# EAGLE design light_module (EAGLE 9.3.0)
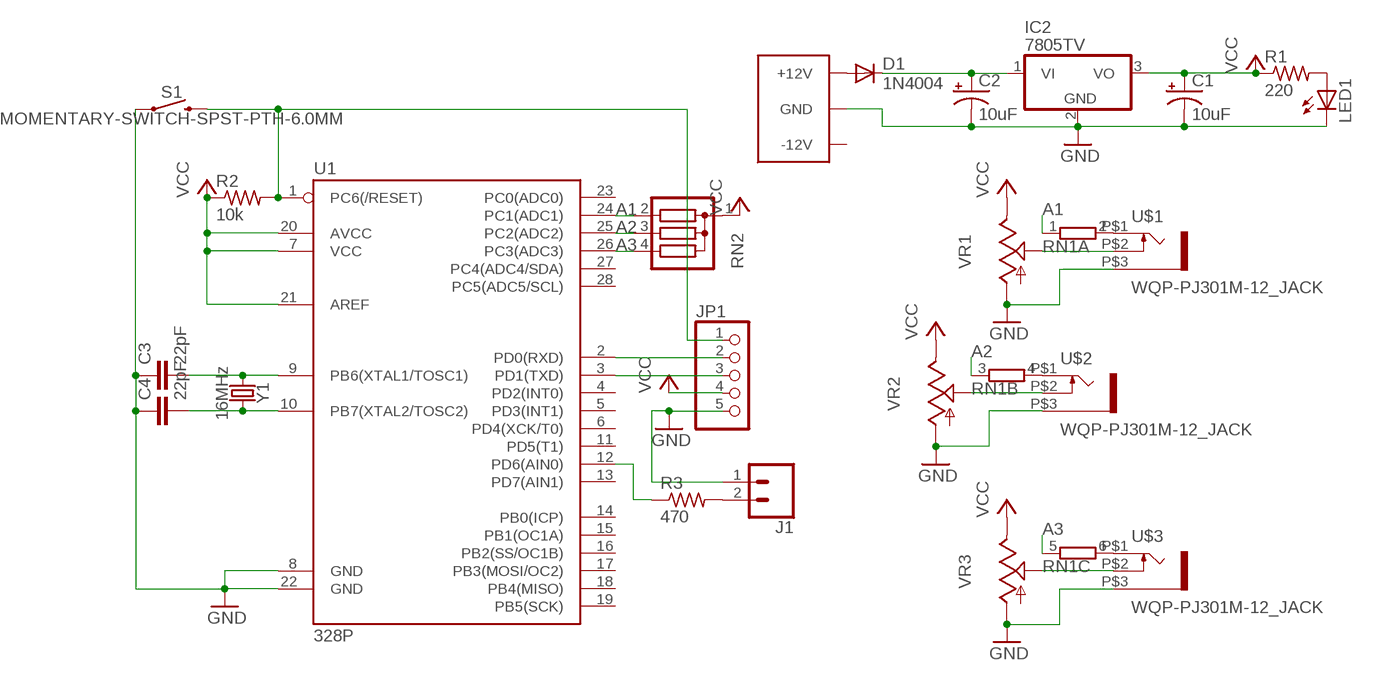
[diagram p0: schematic, sheet 1]

## Parts
C1  10uF  10UF-POLAR-RADIAL-2.5MM-25V-20%  [CPOL-RADIAL-2.5MM-5MM]
C2  10uF  10UF-POLAR-RADIAL-2.5MM-25V-20%  [CPOL-RADIAL-2.5MM-5MM]
C3  22pF  22PF-PTH-2.54MM-200V-5%  [CAP-PTH-2.54]
C4  22pF  22PF-PTH-2.54MM-200V-5%  [CAP-PTH-2.54]
C5  EURO_POWER_LOCKSKINNY  [EURO_POWER_HEADER]
D1  1N4004  [DO41-10]
IC2  7805TV  [TO220V]
J1  CONN_02SPRING-2.54-RA  [SPRINGTERMINAL-2.54MM-2]
JP1  PINHD-1X5  [1X05]
LED1  LED5MM  [LED5MM]
R1  220  R-US_0207/2V  [0207/2V]
R2  10k  R-US_0207/2V  [0207/2V]
R3  470  R-US_0207/2V  [0207/2V]
RN1  E3R  [SIL6]
RN2  G03R  [SIL4]
S1  MOMENTARY-SWITCH-SPST-PTH-6.0MM  [TACTILE_SWITCH_PTH_6.0MM]
U1  328P  ATMEGA328P_PDIP  [DIP28]
U$1  WQP-PJ301M-12_JACK  [WQP-PJ301M-12_JACK]
U$2  WQP-PJ301M-12_JACK  [WQP-PJ301M-12_JACK]
U$3  WQP-PJ301M-12_JACK  [WQP-PJ301M-12_JACK]
VR1  9MM_SNAP-IN_POT_  [9MM_SNAP-IN_POT]
VR2  9MM_SNAP-IN_POT_  [9MM_SNAP-IN_POT]
VR3  9MM_SNAP-IN_POT_  [9MM_SNAP-IN_POT]
Y1  16MHz  CRYSTAL-16MHZPTH-HC49US  [HC49US]

## Nets
A1: RN1.1 RN2.2 U1.24(PC1(ADC1))
A2: RN1.3 RN2.3 U1.25(PC2(ADC2))
A3: RN1.5 RN2.4 U1.26(PC3(ADC3))
GND: C1.2(-) C2.2(-) C3.1 C4.1 C5.3(GND) C5.4(GND) C5.5(GND) C5.6(GND) C5.7(GND) C5.8(GND) IC2.2(GND) J1.1 JP1.5 LED1.K(C) S1.1 U1.8(GND) U1.22(GND) U$1.P$3 U$2.P$3 U$3.P$3 VR1.1(A) VR2.1(A) VR3.1(A)
N$1: C5.9(+12V) C5.10(+12V) D1.A
N$2: C2.1(+) D1.C IC2.1(VI)
N$3: LED1.A R1.2
N$4: JP1.1 R2.2 S1.3 U1.1(PC6(/RESET))
N$5: C3.2 U1.9(PB6(XTAL1/TOSC1)) Y1.1
N$6: C4.2 U1.10(PB7(XTAL2/TOSC2)) Y1.2
N$7: JP1.2 U1.2(PD0(RXD))
N$8: JP1.3 U1.3(PD1(TXD))
N$9: U$1.P$2 VR1.2(S)
N$10: U$2.P$2 VR2.2(S)
N$11: U$3.P$2 VR3.2(S)
N$12: J1.2 R3.2
N$13: R3.1 U1.12(PD6(AIN0))
N$14: RN1.2 U$1.P$1
N$15: RN1.4 U$2.P$1
N$16: RN1.6 U$3.P$1
VCC: C1.1(+) IC2.3(VO) JP1.4 R1.1 R2.1 RN2.1 U1.7(VCC) U1.20(AVCC) U1.21(AREF) VR1.3(E) VR2.3(E) VR3.3(E)
Unconnected: C5.1(-12V) C5.2(-12V) U1.4(PD2(INT0)) U1.5(PD3(INT1)) U1.6(PD4(XCK/T0)) U1.11(PD5(T1)) U1.13(PD7(AIN1)) U1.14(PB0(ICP)) U1.15(PB1(OC1A)) U1.16(PB2(SS/OC1B)) U1.17(PB3(MOSI/OC2)) U1.18(PB4(MISO)) U1.19(PB5(SCK)) U1.23(PC0(ADC0)) U1.27(PC4(ADC4/SDA)) U1.28(PC5(ADC5/SCL))

## Library data of the parts
C1 C2 = SparkFun-Capacitors:10UF-POLAR: 10.0µF polarized capacitors A capacitor is a passive two-terminal electrical component used to store electrical energy temporarily in an electric field.; PROD_ID: CAP-08440
C3 C4 = SparkFun-Capacitors:22PF: 22pF ceramic capacitors A capacitor is a passive two-terminal electrical component used to store electrical energy temporarily in an electric field.; PROD_ID: CAP-09128
C5 = MusicThingModular:EURO_POWER_LOCK
D1 = adafruit:1N4004: DIODE General purpose 1N400x type rectifier (With bigger pads) http://www.ladyada.net/library/pcb/eaglelibrary.html
IC2 = linear:78*: Positive VOLTAGE REGULATOR Source: http://cache.national.com/ds/LM/LM78L05.pdf http://www.fairchildsemi.com/ds/LM/LM7805.pdf
J1 = SparkFun-Connectors:CONN_02: Multi connection point. Often used as Generic Header-pin footprint for 0.1 inch spaced/style header connections On any of the 0.1 inch spaced packages, you can populate with these: Break Away Headers - Straight <https://www.sparkfun.com/products/116> (PRT-00116) Break Away Male Headers - Right Angle <https://www.sparkfun.com/products/553> (PRT-00553) Female Headers <https://www.sparkfun.com/products/115> (PRT-00115) Break Away Headers - Machine Pin <https://www.sparkfun.com/products/117> (PRT-00117) Break Away Female Headers - Swiss Machine Pin <https://www.sparkfun.com/products/743> (PRT-00743) For SCREWTERMINALS and SPRING TERMINALS visit here: Screw Terimnals on SparkFun.com <https://www.sparkfun.com/search/results?term=Screw+Terminals> (5mm/3.5mm/2.54mm spacing) This device is also useful as a general connection point to wire up your design to another part of your project. Our various solder wires solder well into these plated through hole pads. Hook-Up Wire - Assortment (Stranded, 22 AWG) <https://www.sparkfun.com/products/11375> (PRT-11375) Hook-Up Wire - Assortment (Solid Core, 22 AWG) <https://www.sparkfun.com/products/11367> (PRT-11367) View the entire wire category on our website here <https://www.sparkfun.com/categories/141> Special notes: Molex polarized connector foot print use with: PRT-08233 with associated crimp pins and housings. 2.54_SCREWTERM for use with PRT-10571. 3.5mm Screw Terminal footprints for PRT-08084 5mm Screw Terminal footprints for use with PRT-08432
JP1 = pinhead:PINHD-1X5: PIN HEADER
LED1 = adafruit:LED: LED OSRAM: - CHIPLED LG R971, LG N971, LY N971, LG Q971, LY Q971, LO R971, LY R971 LH N974, LH R974 LS Q976, LO Q976, LY Q976 LO Q996 - Hyper CHIPLED LW Q18S LB Q993, LB Q99A, LB R99A - SideLED LS A670, LO A670, LY A670, LG A670, LP A670 LB A673, LV A673, LT A673, LW A673 LH A674 LY A675 LS A676, LA A676, LO A676, LY A676, LW A676 LS A679, LY A679, LG A679 - Hyper Micro SIDELED® LS Y876, LA Y876, LO Y876, LY Y876 LT Y87S - SmartLED LW L88C, LW L88S LB L89C, LB L89S, LG L890 LS L89K, LO L89K, LY L89K LS L896, LA L896, LO L896, LY L896 - TOPLED LS T670, LO T670, LY T670, LG T670, LP T670 LSG T670, LSP T670, LSY T670, LOP T670, LYG T670 LG T671, LOG T671, LSG T671 LB T673, LV T673, LT T673, LW T673 LH T674 LS T676, LA T676, LO T676, LY T676, LB T676, LH T676, LSB T676, LW T676 LB T67C, LV T67C, LT T67C, LS T67K, LO T67K, LY T67K, LW E67C LS E67B, LA E67B, LO E67B, LY E67B, LB E67C, LV E67C, LT E67C LW T67C LS T679, LY T679, LG T679 LS T770, LO T770, LY T770, LG T770, LP T770 LB T773, LV T773, LT T773, LW T773 LH T774 LS E675, LA E675, LY E675, LS T675 LS T776, LA T776, LO T776, LY T776, LB T776 LHGB T686 LT T68C, LB T68C - Hyper Mini TOPLED® LB M676 - Mini TOPLED Santana® LG M470 LS M47K, LO M47K, LY M47K Source: http://www.osram.convergy.de/
R1-R3 = resistor:R-US_: RESISTOR, American symbol
RN1 = resistor-sil:E3R: SIL RESISTOR; OC_FARNELL: unknown; OC_NEWARK: unknown
RN2 = resistor-sil:G03R: SIL RESISTOR; OC_FARNELL: unknown; OC_NEWARK: unknown
S1 = SparkFun-Switches:MOMENTARY-SWITCH-SPST: Momentary Switch (Pushbutton) - SPST Normally-open (NO) SPST momentary switches (buttons, pushbuttons). Variants PTH-12MM - 12mm square, through-hole Momentary Pushbutton Switch - 12mm Square <https://www.sparkfun.com/products/9190> (COM-09190) PTH-6.0MM, PTH-6.0MM-KIT - 6.0mm square, through-hole Mini Pushbutton Switch <https://www.sparkfun.com/products/97> (COM-00097) KIT package intended for soldering kit's - only one side of pads' copper is exposed. PTH-RIGHT-ANGLE-KIT - Right-angle, through-hole Right Angle Tactile Button <https://www.sparkfun.com/products/10791> - Used on SparkFun BigTime Watch Kit <https://www.sparkfun.com/products/11734> SMD-12MM - 12mm square, surface-mount Tactile Button - SMD (12mm) <https://www.sparkfun.com/products/12993> (COM-12993) Used on SparkFun PicoBoard <https://www.sparkfun.com/products/11888> SMD-4.5MM - 4.5mm Square Trackball Switch Used on SparkFun Blackberry Trackballer Breakout <https://www.sparkfun.com/products/13169> SMD-4.6MMX2.8MM - 4.60mm x 2.80mm, surface mount Used on SparkFun SAMD21 Mini Breakout <https://www.sparkfun.com/products/13664> SMD-5.2MM, SMD-5.2-REDUNDANT - 5.2mm square, surface-mount Mini Pushbutton Switch - SMD <https://www.sparkfun.com/products/8720> (COM-08720) Used on Arduino Pro Mini <https://www.sparkfun.com/products/11114> REDUNDANT package connects both switch circuits together SMD-6.0X3.5MM - 6.0 x 3.5mm, surface mount Momentary Reset Switch SMD <https://www.sparkfun.com/products/8229> (COM-08229) SMD-6.2MM-TALL - 6.2mm square, surface mount Tactile Button - SMD (6mm) <https://www.sparkfun.com/products/12992> Used on SparkFun Digital Sandbox <https://www.sparkfun.com/products/12651> SMD-RIGHT-ANGLE - Right-angle, surface mount Used on SparkFun Block for Intel® Edison - Arduino <https://www.sparkfun.com/products/13036>; PROD_ID: SWCH-08441; SF_SKU: COM-00097
U1 = SparkFun-IC-Microcontroller:ATMEGA328P_PDIP: Atmel 328P Through hole ATMEGA328P uC used in the Arduino 32kb flash, 1k EEPROM, 2k SRAM Datasheet <http://www.sparkfun.com/datasheets/Components/SMD/ATMega328.pdf> SparkFun Products Storefront component: AVR 28 Pin 20MHz 32K 6A/D - ATMega328P <https://www.sparkfun.com/products/9061> (COM-09061) SparkFun Simon Says - Through-Hole Soldering Kit <https://www.sparkfun.com/products/10547> (KIT-10547) SparkFun Learn to Solder - Simon Says <https://www.sparkfun.com/products/13708> (KIT-13708) SparkFun BigTime Watch Kit <https://www.sparkfun.com/products/11734> (KIT-11734) SparkFun ClockIt <https://www.sparkfun.com/products/10930> (KIT-10930) SparkFun Serial Enabled LCD Kit <https://www.sparkfun.com/products/10097> (LCD-10097) SparkFun Simon Tilts - Through Hole Soldering Kit <https://www.sparkfun.com/products/12634> (KIT-12634) SparkFun Frequency Counter Kit <https://www.sparkfun.com/products/10140> (KIT-10140) FabFM Radio Kit <https://www.sparkfun.com/products/11043> (KIT-11043) SparkFun Binary Blaster Kit <https://www.sparkfun.com/products/12037> (KIT-12037) SparkFun Metro-Gnome <https://www.sparkfun.com/products/9236> (KIT-09236) ATmega328 with Arduino Optiboot (Uno) <https://www.sparkfun.com/products/10524> (DEV-10524); PROD_ID: IC-09136
U$1-U$3 = thonkiconn:WQP-PJ301M-12_JACK
VR1-VR3 = MusicThingModular:9MM_SNAP-IN_POT: 9mm vertical snap-in pot, Alpha / Panasonic style
Y1 = SparkFun-Clocks:CRYSTAL-16MHZ: 16MHz Crystal Digikey Example <http://www.digikey.com/product-search/en?keywords=535-9122-1-ND> Frequency: 16MHz Frequency Stability: ±50ppm Frequency Tolerance: ±20ppm Load Capacitance: 18pF SparkFun Products: Pro Micro -5V/16MHz <https://www.sparkfun.com/products/12640> SparkFun Serial Enabled LCD Kit <https://www.sparkfun.com/products/10097>; PROD_ID: XTAL-08181; SF_ID: COM-00536

## Board
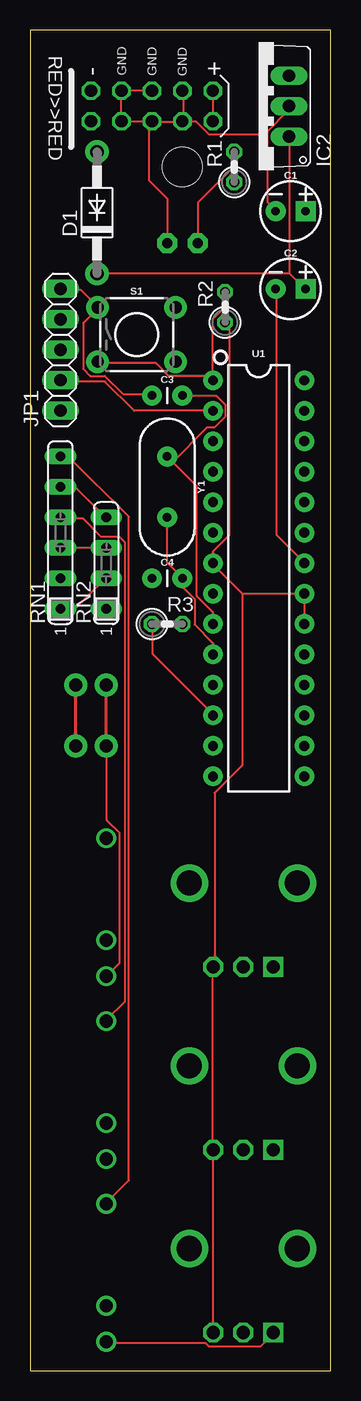
[diagram p1: board, top side]
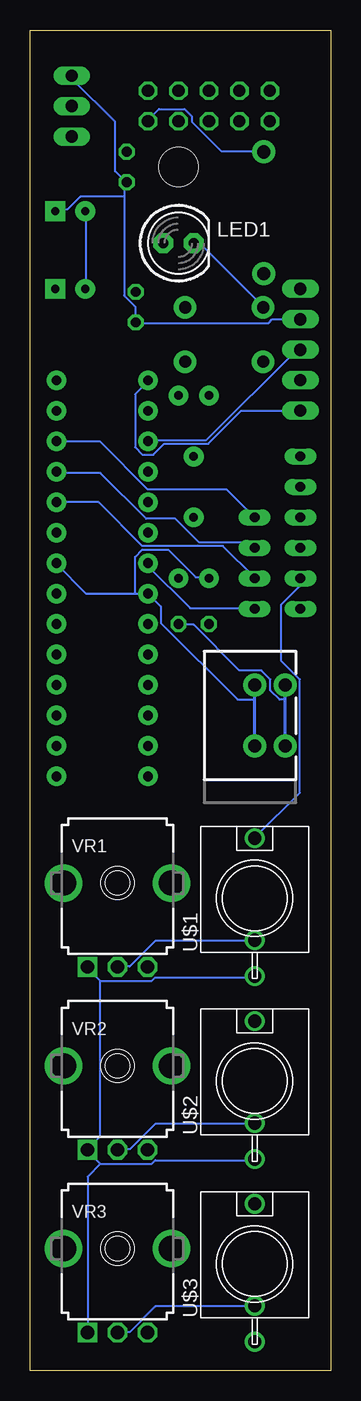
[diagram p2: board, bottom side, seen from below]

Size 25.07 x 111.75 mm. Coordinates in mm from the lower left corner, seen from the top.
Outline: 0,0 25.07,0 25.07,111.75 0,111.75 0,0
Copper layers (1*16): Top 0.035mm / dielectric 1.5mm / Bottom 0.035mm
Design rules "default": minimum track width 6mil, minimum drill 0.35mm, track to track 6mil, track to pad 6mil, pad to pad 6mil, via to via 6mil, smd to smd 6mil, copper to edge 40mil, drill to drill 6mil, minimum pad ring 10mil, minimum via ring 8mil, stop-mask expansion 4mil, vias tented up to drill 0mil, thermal gap 10mil
Holes 3.3 mm at 12.7,100.33

### Footprints (pad centres in the part's own frame; a part is rotated, then mirrored left to right if it is on the bottom)
CPOL-RADIAL-2.5MM-5MM = drill 0.7 pad 1.651 square: 1 1.25,0 | drill 0.7 pad 1.651: 2 -1.25,0
CAP-PTH-2.54 = drill 0.7 pad 1.651: 1 -1.27,0; 2 1.27,0
EURO_POWER_HEADER = drill 1.016 octagon: 1 -5.08,-1.27; 2 -5.08,1.27; 3 -2.54,-1.27; 4 -2.54,1.27; 5 0,-1.27; 6 0,1.27; 7 2.54,-1.27; 8 2.54,1.27; 9 5.08,-1.27; 10 5.08,1.27
DO41-10 = drill 1.118 pad 1.93: A 5.08,0; C -5.08,0
TO220V = drill 1.016 long: 1 -2.54,-2.54; 2 0,-2.54; 3 2.54,-2.54
SPRINGTERMINAL-2.54MM-2 = drill 1.1 pad 1.9: 1 0,0; 2 2.54,0; P$2 0,5.08; P$3 2.54,5.08
1X05 = drill 1.016 long: 1 -5.08,0; 2 -2.54,0; 3 0,0; 4 2.54,0; 5 5.08,0
LED5MM = drill 0.813 pad 1.676 octagon: A -1.27,0; K 1.27,0
0207/2V = drill 0.813 octagon: 1 -1.27,0; 2 1.27,0
SIL6 = drill 0.813 long: 1 -6.35,0; 2 -3.81,0; 3 -1.27,0; 4 1.27,0; 5 3.81,0; 6 6.35,0
SIL4 = drill 0.813 long: 1 -3.81,0; 2 -1.27,0; 3 1.27,0; 4 3.81,0
TACTILE_SWITCH_PTH_6.0MM = drill 1.016 pad 1.88: 1 -3.251,2.261; 2 3.251,2.261; 3 -3.251,-2.261; 4 3.251,-2.261
DIP28 = drill 0.813 pad 1.626: 1 -16.51,-3.81; 2 -13.97,-3.81; 3 -11.43,-3.81; 4 -8.89,-3.81; 5 -6.35,-3.81; 6 -3.81,-3.81; 7 -1.27,-3.81; 8 1.27,-3.81; 9 3.81,-3.81; 10 6.35,-3.81; 11 8.89,-3.81; 12 11.43,-3.81; 13 13.97,-3.81; 14 16.51,-3.81; 15 16.51,3.81; 16 13.97,3.81; 17 11.43,3.81; 18 8.89,3.81; 19 6.35,3.81; 20 3.81,3.81; 21 1.27,3.81; 22 -1.27,3.81; 23 -3.81,3.81; 24 -6.35,3.81; 25 -8.89,3.81; 26 -11.43,3.81; 27 -13.97,3.81; 28 -16.51,3.81
WQP-PJ301M-12_JACK = drill 1.1: P$1 0,5; P$2 0,-3.5; P$3 0,-6.5
9MM_SNAP-IN_POT = drill 1.1 square: 1 -2.5,-7 | drill 1.1 octagon: 2 0,-7; 3 2.5,-7 | drill 2.1 pad 2.794: CHASSIS1 -4.5,0; CHASSIS2 4.5,0
HC49US = drill 0.7 pad 1.651: 1 -2.54,0; 2 2.54,0

### Placement (x,y rotation side)
C1  21.72,96.65 0 top
C2  21.72,90.17 0 top
C3  11.43,81.28 0 top
C4  11.43,66.04 0 top
C5  10.16,105.41 0 top
D1  5.59,96.52 90 top
IC2  19.05,105.41 90 top
J1  6.35,52.07 0 bottom
JP1  2.54,85.09 90 top
LED1  12.7,93.98 0 bottom
R1  17.02,100.33 90 top
R2  16.26,88.65 90 top
R3  11.43,62.23 0 top
RN1  2.54,69.85 90 top
RN2  6.35,67.31 90 top
S1  8.89,86.36 0 top
U1  19.05,66.04 270 top
U$1  6.35,39.37 0 bottom
U$2  6.35,24.13 0 bottom
U$3  6.35,8.89 0 bottom
VR1  17.78,40.64 0 bottom
VR2  17.78,25.4 0 bottom
VR3  17.78,10.16 0 bottom
Y1  11.43,73.66 270 top

### Tracks (layer width: path | path; a pad name or v marks a point on that pad's centre or on a via)
A1
  Top 0.152: RN1.1 2.59,63.55 3.81,63.55 6.25,65.99 RN2.2
  Bottom 0.152: U1.24 19.36,72.39 15.7,68.73 8.99,68.73 6.4,66.14 RN2.2
A2
  Top 0.152: RN2.3 RN1.3
  Bottom 0.152: U1.25 22.86,74.83 19.2,74.83 15.39,71.02 12.95,71.02 10.97,69.04 6.86,69.04 6.4,68.58 RN2.3
A3
  Top 0.152: RN1.5 2.59,73.61 3.81,73.61 6.25,71.17 RN2.4
  Bottom 0.152: RN2.4 8.69,73.46 15.24,73.46 19.2,77.42 22.86,77.42 U1.26
GND
  Top 0.152: JP1.5 2.59,90.07 4.27,90.07 5.64,88.7 S1.1 5.64,88.54 4.42,87.33 4.42,83.52 5.03,82.91 6.25,82.91 7.77,81.38 10.06,81.38 C3.1 | C5.6 C5.4 C5.3 7.62,104.09 9.91,104.09 | 9.91,104.09 10.06,104.09 C5.5 | C5.7 12.65,104.09 10.21,104.09 C5.5 | C5.8 12.8,106.68 12.8,104.24 C5.7 | 19.81,103.02 19.81,97.38 20.42,96.77 C1.2 | 19.81,103.02 19.81,103.33 21.49,105 21.49,105.31 IC2.2 | 19.81,103.02 14.94,103.02 13.87,104.09 12.8,104.09 C5.7 | LED1.K 11.43,97.69 9.91,99.21 9.91,104.09 | 9.91,104.09 C5.5 | U$3.P$3 6.4,2.29 14.63,2.29 14.94,1.98 19.2,1.98 20.27,3.05 VR3.1 | J1.1 6.4,51.97 6.4,45.87 7.47,44.81 7.47,33.98 6.4,32.92 U$1.P$3 | C2.2 20.57,90.07 20.57,69.65 22.86,67.36 U1.22
  Bottom 0.152: LED1.K 11.43,93.88 10.82,93.88 5.64,88.7 S1.1 | C2.2 20.42,90.22 20.42,96.62 C1.2 | 16.31,64.77 20.42,64.77 22.86,67.21 U1.22 | 16.31,64.77 U1.8 14.17,63.7 14.17,62.33 7.77,55.93 6.4,55.93 J1.1 | 16.31,64.77 16.31,67.82 15.7,68.43 13.56,68.43 11.28,66.14 10.21,66.14 C4.1 | 19.2,32.46 14.94,32.46 14.63,32.77 6.4,32.77 U$1.P$3 | 19.2,32.46 20.27,33.53 VR1.1 | 19.2,17.22 14.94,17.22 14.63,17.53 6.4,17.53 U$2.P$3 | 19.2,17.22 20.27,18.29 VR2.1 20.27,18.44 19.2,19.51 19.2,32.46 | 19.2,17.22 20.27,16.15 20.27,3.2 VR3.1
N$1
  Top 0.152: C5.10 C5.9
  Bottom 0.152: D1.A 5.64,101.65 9.14,101.65 11.58,104.09 11.58,104.55 12.19,105.16 14.33,105.16 15.24,104.24 C5.9
N$2
  Top 0.152: 21.64,91.44 21.64,102.87 IC2.1 | 21.64,91.44 22.86,90.22 C2.1 | 21.64,91.44 D1.C
N$3
  Top 0.152: R1.2 16.92,101.5 16.92,100.28 14.02,97.38 14.02,94.03 LED1.A
N$4
  Top 0.152: 15.24,82.91 U1.1 15.24,82.6 | 15.24,82.91 15.24,87.63 16.15,88.54 16.15,89.92 R2.2 | 15.24,82.91 11.58,82.91 10.52,83.97 5.64,83.97 S1.3
  Bottom 0.152: JP1.1 7.47,80.01 10.21,77.27 13.87,77.27 14.78,76.35 15.7,76.35 16.31,76.96 16.31,81.38 15.24,82.45 U1.1
N$5
  Top 0.152: U1.9 15.24,63.25 13.87,64.62 13.87,73.76 11.89,75.74 | 11.89,75.74 14.78,78.64 15.39,78.64 16.31,79.55 16.31,80.47 15.54,81.23 12.8,81.23 C3.2 | 11.89,75.74 Y1.1
N$6
  Top 0.152: U1.10 15.24,60.66 13.72,62.18 13.72,64.31 12.8,65.23 12.8,65.99 C4.2 12.65,66.14 11.43,67.36 Y1.2
N$7
  Top 0.152: U1.2 8.69,80.01 6.25,82.45 2.59,82.45 JP1.2
N$8
  Bottom 0.152: JP1.3 2.59,85.04 2.9,85.04 10.36,77.57 15.24,77.57 U1.3
N$9
  Bottom 0.152: VR1.2 17.68,33.68 16.76,33.68 14.63,35.81 6.4,35.81 U$1.P$2
N$10
  Bottom 0.152: VR2.2 17.68,18.44 16.76,18.44 14.63,20.57 6.4,20.57 U$2.P$2
N$11
  Bottom 0.152: VR3.2 17.68,3.2 16.76,3.2 14.63,5.33 6.4,5.33 U$3.P$2
N$12
  Bottom 0.152: R3.2 12.65,62.18 11.43,62.18 7.62,58.37 5.79,58.37 5.03,57.61 5.03,56.69 4.27,55.93 3.81,55.93 J1.2
N$13
  Top 0.152: R3.1 10.21,62.18 10.21,59.74 15.24,54.71 U1.12
N$14
  Bottom 0.152: RN1.2 2.59,65.99 2.59,65.38 4.12,63.86 4.12,59.13 2.59,57.61 2.59,48.16 6.25,44.5 U$1.P$1
N$15
  Top 0.152: RN1.4 2.59,71.02 4.42,71.02 5.94,69.49 7.47,69.49 7.92,69.04 7.92,30.79 6.4,29.26 U$2.P$1
N$16
  Top 0.152: RN1.6 3.2,76.2 8.23,71.17 8.23,15.85 6.4,14.02 U$3.P$1
VCC
  Top 0.152: VR3.3 15.24,3.2 15.24,18.29 VR2.3 15.24,18.44 15.24,33.53 VR1.3 15.39,33.68 15.39,48.16 17.68,50.44 17.68,64.77 | U1.20 U1.21 17.68,64.77 | 17.68,64.77 15.24,67.21 U1.7 15.24,68.28 16.61,69.65 16.61,87.02 R2.1
  Bottom 0.152: U1.7 15.24,67.06 11.73,63.55 6.4,63.55 RN2.1 | 17.22,97.84 17.22,98.91 17.07,99.06 | 17.22,97.84 17.22,89.61 16.31,88.7 16.31,87.48 R2.1 16.15,87.33 5.18,87.33 4.88,87.63 JP1.4 | 17.07,99.06 17.98,99.97 17.98,104.09 21.49,107.59 21.49,107.9 IC2.3 | 17.07,99.06 R1.1 | 17.22,97.84 20.88,97.84 21.95,96.77 22.86,96.77 C1.1